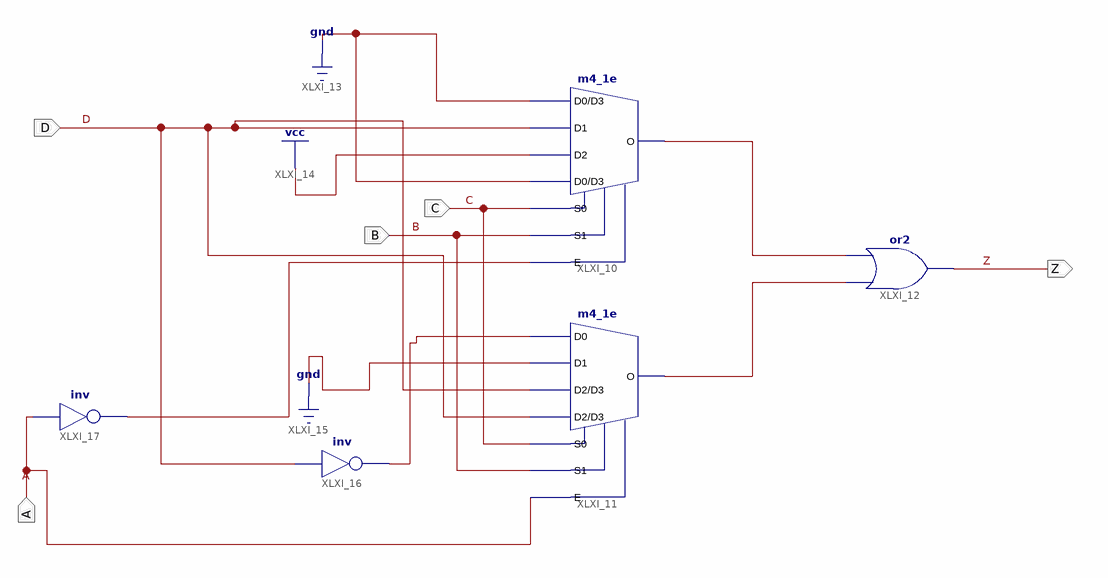
[diagram p0: schematic sheet 1]
// Xilinx ISE schematic p2ej1b.sch (artix7) as structural Verilog: 5 symbols, 5 ports
module p2ej1b (
  input  D,
  input  C,
  input  A,
  input  B,
  output Z
);

  wire XLXN_24, XLXN_25, XLXN_48, XLXN_54;

  m4_1e XLXI_10 (.D0(1'b0), .D1(D), .D2(1'b1), .D3(1'b0), .E(XLXN_48), .S0(C), .S1(B), .O(XLXN_25));
  m4_1e XLXI_11 (.D0(XLXN_54), .D1(1'b0), .D2(D), .D3(D), .E(A), .S0(C), .S1(B), .O(XLXN_24));
  or XLXI_12 (Z, XLXN_24, XLXN_25);
  not XLXI_16 (XLXN_54, D);
  not XLXI_17 (XLXN_48, A);
endmodule
